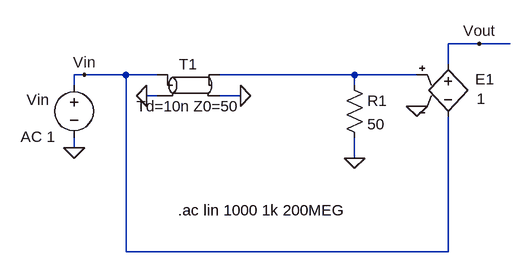
[diagram p0: schematic _Fig1_17_AC_MSD.asc]
_Fig1_17_AC_MSD.asc, the LTspice schematic file:
Version 4
SHEET 1 1056 688
WIRE 704 256 656 256
WIRE 752 256 704 256
WIRE 656 288 656 256
WIRE 96 304 80 304
WIRE 160 304 96 304
WIRE 208 304 160 304
WIRE 512 304 304 304
WIRE 608 304 512 304
WIRE 80 320 80 304
WIRE 512 320 512 304
WIRE 208 336 192 336
WIRE 336 336 304 336
WIRE 80 416 80 400
WIRE 512 432 512 400
WIRE 160 576 160 304
WIRE 656 576 656 368
WIRE 656 576 160 576
FLAG 512 432 0
FLAG 336 336 0
FLAG 192 336 0
FLAG 80 416 0
FLAG 96 304 Vin
FLAG 704 256 Vout
FLAG 608 352 0
SYMBOL tline 256 320 R0
SYMATTR InstName T1
SYMATTR Value Td=10n Z0=50
SYMBOL res 496 304 R0
SYMATTR InstName R1
SYMATTR Value 50
SYMBOL voltage 80 304 R0
WINDOW 0 -73 38 Left 0
WINDOW 123 -82 95 Left 0
WINDOW 39 0 0 Left 0
SYMATTR InstName Vin
SYMATTR Value2 AC 1
SYMATTR Value ""
SYMBOL e 656 272 R0
WINDOW 0 42 39 Left 0
WINDOW 3 44 69 Left 0
SYMATTR InstName E1
SYMATTR Value 1
TEXT 240 512 Left 0 !.ac lin 1000 1k 200MEG

The netlist it stands for:
* _Fig1_17_AC_MSD.asc
T1 Vin 0 N001 0 Td=10n Z0=50
R1 N001 0 50
Vin Vin 0 AC 1
E1 Vout Vin N001 0 1
.ac lin 1000 1k 200MEG
.backanno
.end